# EAGLE design bandpass_module (EAGLE 7.7.0)
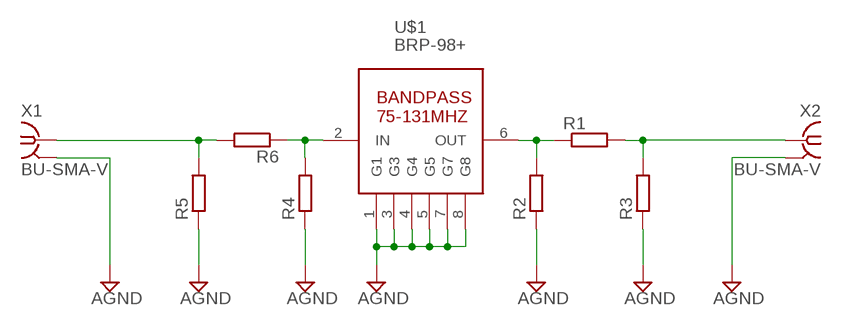
[diagram p0: schematic, sheet 1]

## Parts
R1  R-EU_R0805  [R0805]
R2  R-EU_R0805  [R0805]
R3  R-EU_R0805  [R0805]
R4  R-EU_R0805  [R0805]
R5  R-EU_R0805  [R0805]
R6  R-EU_R0805  [R0805]
U$1  BRP-98+  [RBP-98+]
X1  BU-SMA-V  [BU-SMA-V]
X2  BU-SMA-V  [BU-SMA-V]

## Nets
AGND: R2.1 R3.1 R4.1 R5.1 U$1.1(G1) U$1.3(G3) U$1.4(G4) U$1.5(G5) U$1.7(G7) U$1.8(G8) X1.2 X1.3 X1.4 X1.5 X2.2 X2.3 X2.4 X2.5
N$2: R4.2 R6.1 U$1.2(IN)
N$3: R5.2 R6.2 X1.1
N$4: R1.1 R2.2 U$1.6(OUT)
N$5: R1.2 R3.2 X2.1

## Library data of the parts
R1-R6 = resistor:R-EU_: RESISTOR, European symbol
U$1 = FM_transmitter:BRP-98+
X1 X2 = con-coax:BU-SMA-V: FEMALE SMA CONNECTOR Radiall distributor RS 112-3794; OC_FARNELL: unknown; OC_NEWARK: unknown

## Board
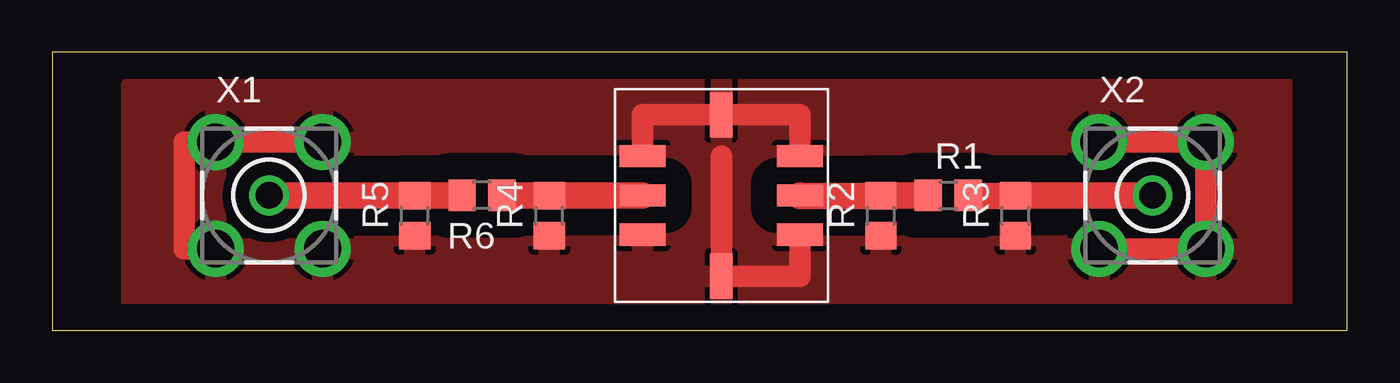
[diagram p1: board, top side]

Size 61.82 x 13.29 mm. Coordinates in mm from the lower left corner, seen from the top.
Outline: 0,0 61.82,0 61.82,13.29 0,13.29 0,0
Copper layers (1*16): Top 0.035mm / dielectric 1.5mm / Bottom 0.035mm
Design rules "default": minimum track width 10mil, minimum drill 24mil, track to track 8mil, track to pad 8mil, pad to pad 8mil, via to via 8mil, smd to smd 8mil, copper to edge 40mil, drill to drill 8mil, minimum pad ring 10mil, minimum via ring 8mil, stop-mask expansion 4mil, vias tented up to drill 0mil, thermal gap 10mil

### Footprints (pad centres in the part's own frame; a part is rotated, then mirrored left to right if it is on the bottom)
R0805 = smd 1.3 x 1.5: 1 -0.95,0; 2 0.95,0
RBP-98+ = smd 1.067 x 2.184: 1 -1.88,-3.76; 2 0,-3.76; 3 1.88,-3.76; 5 1.88,3.76; 6 0,3.76; 7 -1.88,3.76 | smd 2.184 x 1.067: 4 3.86,0; 8 -3.86,0
BU-SMA-V = drill 1.27: 1 0,0 | drill 1.778: 2 -2.55,2.55; 3 2.55,2.55; 4 2.55,-2.55; 5 -2.55,-2.55

### Placement (x,y rotation side)
R1  42.77,6.45 0 top
R2  39.56,5.48 90 top
R3  45.98,5.48 90 top
R4  23.72,5.48 90 top
R5  17.3,5.48 90 top
R6  20.51,6.45 180 top
U$1  31.94,6.45 270 top
X1  10.35,6.45 0 top
X2  52.53,6.45 0 top

### Tracks (layer width: path | path; a pad name or v marks a point on that pad's centre or on a via)
AGND
  Top 1.016: U$1.1 28.18,10.31 U$1.8 35.7,10.31 U$1.7 | U$1.5 35.7,2.59 U$1.4 31.94,8.33 | 28.18,4.53 U$1.3 | 12.9,4.53 X1.4 | X1.3 8.3,9 | 8.3,9 X1.2 | 39.56,4.57 R2.1 | 49.98,4.53 X2.5 X2.4 X2.3 X2.2 | X1.5 6.3,3.9 6.3,9 8.3,9 | 8.3,9
  pour Top (isolate 1.27): 3.8,11.7 3.8,0.9 58.7,1 58.7,11.8
N$2
  Top 1.27: R6.1 23.72,6.45 | U$1.2 23.72,6.45 | 23.72,6.45 R4.2
N$3
  Top 1.27: X1.1 17.3,6.45 | R6.2 17.3,6.45 | 17.3,6.45 R5.2
N$4
  Top 1.27: R1.1 39.56,6.45 R2.2 35.7,6.43 U$1.6
N$5
  Top 1.27: X2.1 45.98,6.45 R3.2 43.72,6.43 R1.2